# Altium schematic sheet Power - 3V3.SchDoc
size A4
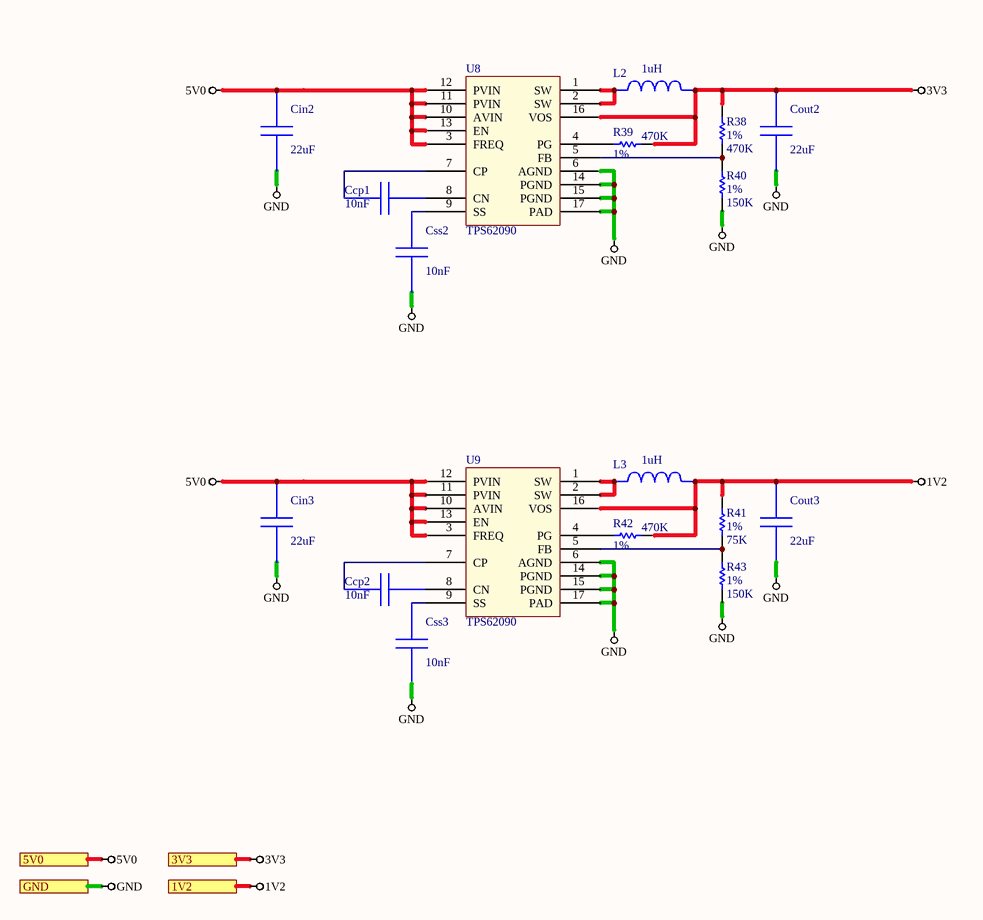
[diagram p0: Power - 3V3.SchDoc]

## Parts
Ccp1  value 10nF  [CAPC0402(1005)60_L]  (hidden comment: GRM155R71E103KA01D)
Ccp2  value 10nF  [CAPC0402(1005)60_L]  (hidden comment: GRM155R71E103KA01D)
Cin2  value 22uF  [C-0805]  (hidden comment: GRM21BR60J226ME39L)
Cin3  value 22uF  [C-0805]  (hidden comment: GRM21BR60J226ME39L)
Cout2  value 22uF  [C-0805]  (hidden comment: GRM21BR60J226ME39L)
Cout3  value 22uF  [C-0805]  (hidden comment: GRM21BR60J226ME39L)
Css2  value 10nF  [CAPC0402(1005)60_L]  (hidden comment: GRM155R71E103KA01D)
Css3  value 10nF  [CAPC0402(1005)60_L]  (hidden comment: GRM155R71E103KA01D)
L2  value 1uH  [XFL4020]  (hidden comment: XFL4020-102MEB)
L3  value 1uH  [XFL4020]  (hidden comment: XFL4020-102MEB)
R38  1%  value 470K  [RESC0402(1005)40_L]
R39  1%  value 470K  [RESC0402(1005)40_L]
R40  1%  value 150K  [RESC0402(1005)40_L]
R41  1%  value 75K  [RESC0402(1005)40_L]
R42  1%  value 470K  [RESC0402(1005)40_L]
R43  1%  value 150K  [RESC0402(1005)40_L]
U8  TPS62090  [RGT16_1P7X1P7]
U9  TPS62090  [RGT16_1P7X1P7]

## Ports
1V2, 3V3, 5V0, GND

## Nets
1V2: Cout3.1 L3.2 R41.2 R42.1 U9.16(VOS) ; port 1V2
3V3: Cout2.1 L2.2 R38.2 R39.1 U8.16(VOS) ; port 3V3
5V0: Cin2.1 Cin3.1 U8.3(FREQ) U8.10(AVIN) U8.11(PVIN) U8.12(PVIN) U8.13(EN) U9.3(FREQ) U9.10(AVIN) U9.11(PVIN) U9.12(PVIN) U9.13(EN) ; port 5V0
GND: Cin2.2 Cin3.2 Cout2.2 Cout3.2 Css2.2 Css3.2 R40.1 R43.1 U8.6(AGND) U8.14(PGND) U8.15(PGND) U8.17(PAD) U9.6(AGND) U9.14(PGND) U9.15(PGND) U9.17(PAD) ; port GND
NetCcp1_1: Ccp1.1 U8.7(CP)
NetCcp1_2: Ccp1.2 U8.8(CN)
NetCcp2_1: Ccp2.1 U9.7(CP)
NetCcp2_2: Ccp2.2 U9.8(CN)
NetCss2_1: Css2.1 U8.9(SS)
NetCss3_1: Css3.1 U9.9(SS)
NetL2_1: L2.1 U8.1(SW) U8.2(SW)
NetL3_1: L3.1 U9.1(SW) U9.2(SW)
NetR38_1: R38.1 R40.2 U8.5(FB)
NetR39_2: R39.2 U8.4(PG)
NetR41_1: R41.1 R43.2 U9.5(FB)
NetR42_2: R42.2 U9.4(PG)

## Library data of the parts
Ccp1 Ccp2 Css2 Css3 = GRM155R71E103KA01D: GRM155R71E103KA0; Manufacturer Name: MuRata; PackageReference: GRM155R71E103KA01D; Manufacturer Part Number: GRM155R71E103KA01D
Cin2 Cin3 Cout2 Cout3 = GRM21BR60J226ME39L: GRM21BR60J226ME3; Manufacturer Name: MuRata; PackageReference: GRM21BR60J226ME39L; Manufacturer Part Number: GRM21BR60J226ME39L
L2 L3 = Inductor-XFL4020-102MEB: Manufacturer Name: Coilcraft; Manufacturer Part Number: XFL4020-102MEB
R38-R43 = Res1: Resistor; Published: 8-Jun-2000; LatestRevisionDate: 17-Jul-2002; LatestRevisionNote: Re-released for DXP Platform.; PackageReference: AXIAL-0.3; Publisher: Altium Limited; PackageDescription: Axial Device, Thru-Hole; 2 Leads; 0.3 in Pin Spacing
U8 U9 = TPS6209X